# EAGLE schematic bootloader (EAGLE 9.5.1)
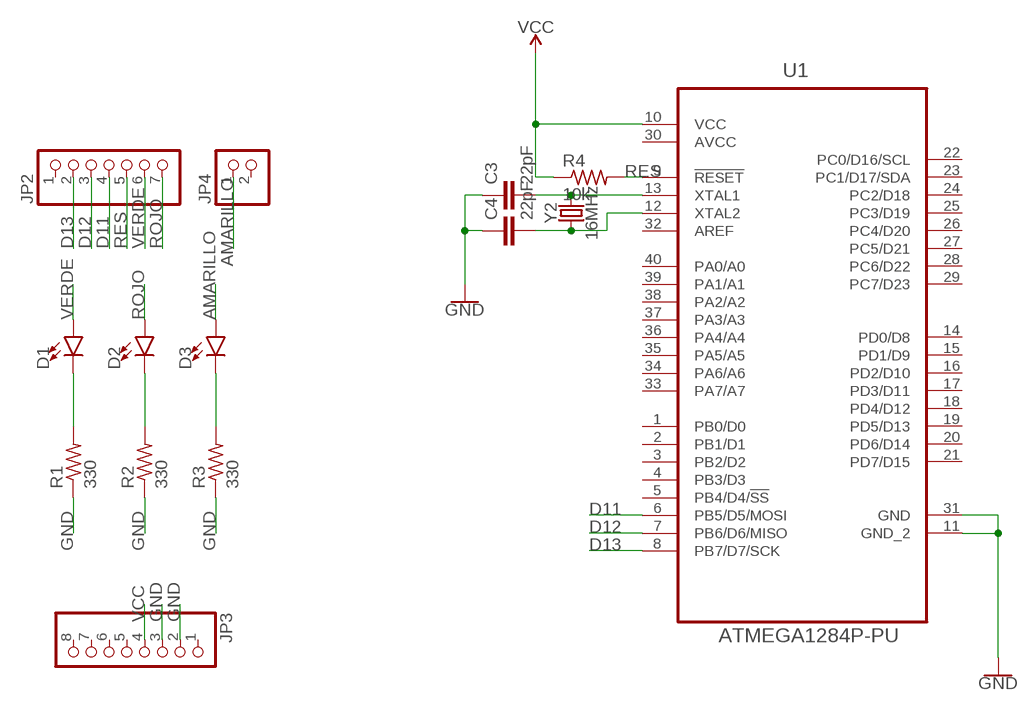
[diagram p0: schematic, sheet 1]

## Parts
C3  22pF  C-EUC1206  [C1206]
C4  22pF  C-EUC1206  [C1206]
D1  LED1206  [LED-1206]
D2  LED1206  [LED-1206]
D3  LED1206  [LED-1206]
JP2  PINHD-1X7  [1X07]
JP3  PINHD-1X8  [1X08]
JP4  PINHD-1X2  [1X02]
R1  330  R-US_R1206  [R1206]
R2  330  R-US_R1206  [R1206]
R3  330  R-US_R1206  [R1206]
R4  10k  R-US_R1206  [R1206]
U1  ATMEGA1284P-PU  [DIP254P1524X483-40]
Y2  16MHz  CRYSTALSMD-5X3.2-4PAD  [CRYSTAL-SMD-5X3.2-4PAD]

## Nets
AMARILLO: D3.A JP4.1
D11: JP2.4 U1.6(PB5/D5/MOSI)
D12: JP2.3 U1.7(PB6/D6/MISO)
D13: JP2.2 U1.8(PB7/D7/SCK)
GND: C3.1 C4.1 JP3.2 JP3.3 R1.1 R2.1 R3.1 U1.11(GND_2) U1.31(GND)
N$1: D1.C R1.2
N$2: D2.C R2.2
N$3: D3.C R3.2
N$6: C4.2 U1.12(XTAL2) Y2.1
N$7: C3.2 U1.13(XTAL1) Y2.3
RES: JP2.5 R4.2 U1.9(!RESET)
ROJO: D2.A JP2.7
VCC: JP3.4 R4.1 U1.10(VCC)
VERDE: D1.A JP2.6
Unconnected: JP2.1 JP3.1 JP3.5 JP3.6 JP3.7 JP3.8 JP4.2 U1.1(PB0/D0) U1.2(PB1/D1) U1.3(PB2/D2) U1.4(PB3/D3) U1.5(PB4/D4/!SS) U1.14(PD0/D8) U1.15(PD1/D9) U1.16(PD2/D10) U1.17(PD3/D11) U1.18(PD4/D12) U1.19(PD5/D13) U1.20(PD6/D14) U1.21(PD7/D15) U1.22(PC0/D16/SCL) U1.23(PC1/D17/SDA) U1.24(PC2/D18) U1.25(PC3/D19) U1.26(PC4/D20) U1.27(PC5/D21) U1.28(PC6/D22) U1.29(PC7/D23) U1.32(AREF) U1.33(PA7/A7) U1.34(PA6/A6) U1.35(PA5/A5) U1.36(PA4/A4) U1.37(PA3/A3) U1.38(PA2/A2) U1.39(PA1/A1) U1.40(PA0/A0)

## Power pins joined to a net without a drawn wire
AVCC: U1.30(AVCC)

## Library data of the parts
C3 C4 = rcl:C-EU: CAPACITOR, European symbol; SPICEPREFIX: C
D1-D3 = SparkFun-LED:LED: LED (Generic) Standard schematic elements and footprints for 5mm, 3mm, 1206, and 0603 sized LEDs. Generic LEDs with no color specified.
JP2 = pinhead:PINHD-1X7: PIN HEADER
JP3 = pinhead:PINHD-1X8: PIN HEADER
JP4 = pinhead:PINHD-1X2: PIN HEADER
R1-R3 = adafruit:R-US_: RESISTOR, American symbol
R4 = rcl:R-US_: RESISTOR, American symbol; SPICEPREFIX: R
U1 = ATMEGA1284P-PU_ExploraTec:ATMEGA1284P-PU: 8-bit Microcontroller with In-System Programmable Flash; AVAILABILITY: Unavailable; DESCRIPTION: ATmega Series 20 MHz 128 KB Flash 16 KB SRAM 8-Bit Microcontroller - DIP-40; MF: Microchip; MP: ATMEGA1284P-PU; PACKAGE: PDIP-40 Microchip; PRICE: None
Y2 = SparkFun-Clocks:CRYSTAL: Crystals (Generic) These are passive quartz crystals, which can be used as a clock source for a microcontroller. Crystal's are two-terminal devices. They require external "load" capacitors to generate an oscillating signal.